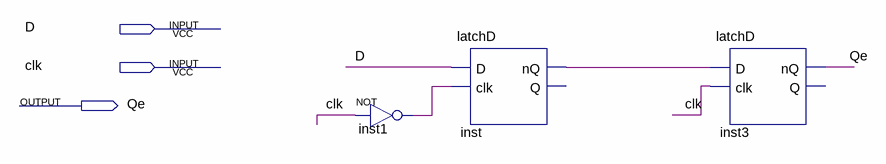
[diagram p0: schematic sheet]
// Quartus schematic flipflopD.bdf as structural Verilog: 3 symbols, 3 pins
module flipflopD (
  input  D,
  input  clk,
  output Qe
);

  wire inst1_out, inst_nq;

  not inst1 (inst1_out, clk);
  latchD inst (.D(D), .clk(inst1_out), .nQ(inst_nq));  // open: Q
  latchD inst3 (.D(inst_nq), .clk(clk), .nQ(Qe));  // open: Q
endmodule
